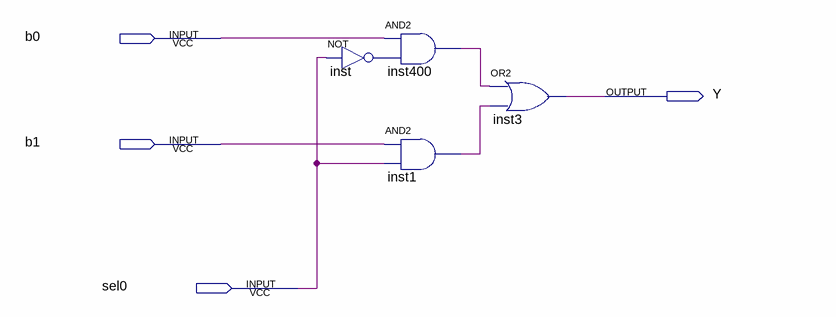
[diagram p0: schematic sheet]
// Quartus schematic MUX2x1.bdf as structural Verilog: 4 symbols, 4 pins
module MUX2x1 (
  input  b0,
  input  b1,
  input  sel0,
  output Y
);

  wire inst1_out, inst400_out, inst_out;

  not inst (inst_out, sel0);
  and inst400 (inst400_out, b0, inst_out);
  and inst1 (inst1_out, b1, sel0);
  or inst3 (Y, inst400_out, inst1_out);
endmodule
